# EasyEDA schematic Node Schematic EasyEDA File.json
TITLE: Node; REV: 1.0; Date: 2024-10-09; Sheet: 1/1; Drawn By: Chathura-De-Silva; Company: Firesense
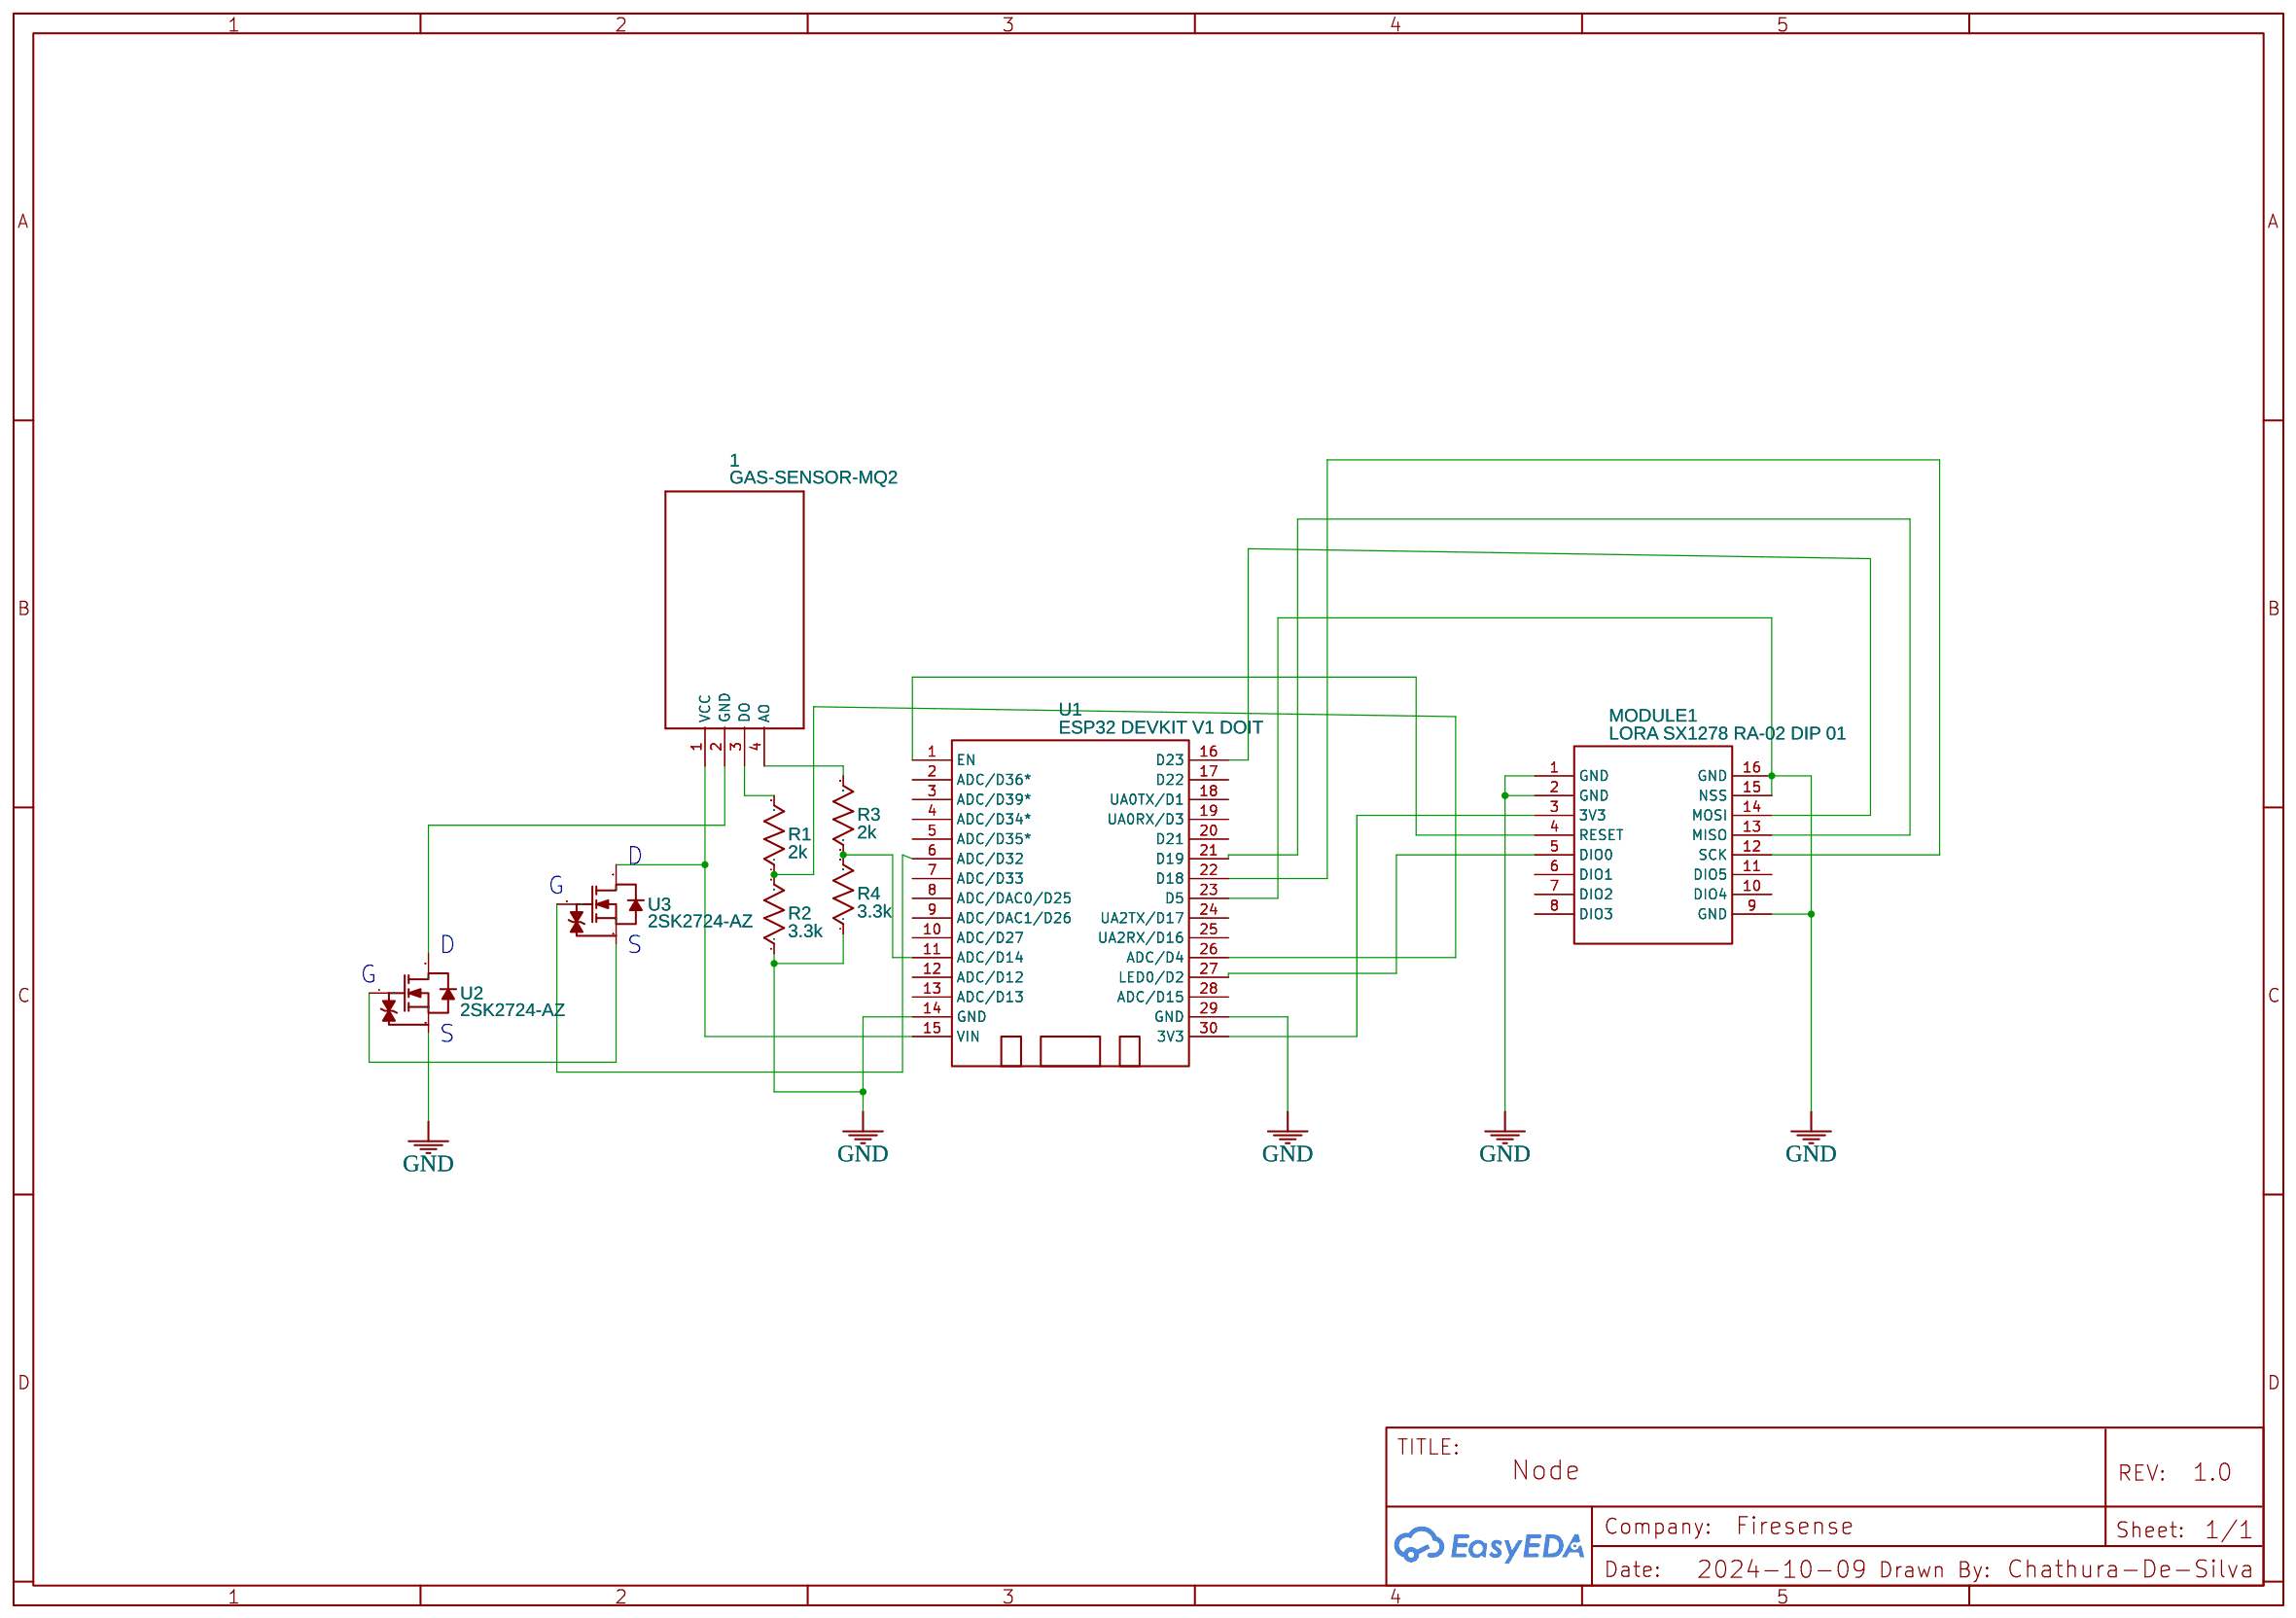
[diagram p0: schematic sheet]

## Parts
1  GAS-SENSOR-MQ2  [GAS-SENSOR-MQ2]
MODULE1  LORA SX1278 RA-02 DIP 01  [LORA SX1278 RA-02 DIP 01]
R1  2k  [R0603]
R2  3.3k  [R0603]
R3  2k  [R0603]
R4  3.3k  [R0603]
U1  ESP32 DEVKIT V1 DOIT  [DOIT-ESP32-DEVKIT-V1]
U2  2SK2724-AZ  [TO-220-3_L10.0-W4.6-P2.54-L]
U3  2SK2724-AZ  [TO-220-3_L10.0-W4.6-P2.54-L]

## Library data of the parts
1 = GAS-SENSOR-MQ2: Contributor: gtanaka6
MODULE1 = LORA SX1278 RA-02 DIP 01: Contributor: rhalfcaacbay
R1-R4 = R_0603_US: Contributor: LCEDA_Lib
U1 = ESP32 DEVKIT V1 DOIT: Contributor: ConceitoTeam
U2 U3 = 2SK2724-AZ: Contributor: lcsc; Supplier: LCSC; Supplier Part: C3282317; Manufacturer: RENESAS(瑞萨)/IDT; JLCPCB Part Class: Extended Part

## Nets
GND: MODULE1.1(GND) MODULE1.2(GND) MODULE1.9(GND) MODULE1.15(NSS) MODULE1.16(GND) R2.1 R4.1 U1.14(GND) U1.23(D5) U1.29(GND) U2.3(S)
Net-(1-1): 1.1(VCC) U1.15(VIN) U3.2(D)
Net-(1-2): 1.2(GND) U2.2(D)
Net-(1-3): 1.3(DO) R1.2
Net-(1-4): 1.4(AO) R3.2
Net-(MODULE1-3): MODULE1.3(3V3) U1.30(3V3)
Net-(MODULE1-4): MODULE1.4(RESET) U1.1(EN)
Net-(MODULE1-5): MODULE1.5(DIO0) U1.27(LED0/D2)
Net-(MODULE1-12): MODULE1.12(SCK) U1.22(D18)
Net-(MODULE1-13): MODULE1.13(MISO) U1.21(D19)
Net-(MODULE1-14): MODULE1.14(MOSI) U1.16(D23)
Net-(R1-1): R1.1 R2.2 U1.26(ADC/D4)
Net-(R3-1): R3.1 R4.2 U1.11(ADC/D14)
Net-(U1-6): U1.6(ADC/D32) U3.1(G)
Net-(U2-1): U2.1(G) U3.3(S)

Not connected (* = marked no-connect by the designer): MODULE1 6(DIO1) 7(DIO2) 8(DIO3) 10(DIO4) 11(DIO5); U1 2(ADC/D36*) 3(ADC/D39*) 4(ADC/D34*) 5(ADC/D35*) 7(ADC/D33) 8(ADC/DAC0/D25) 9(ADC/DAC1/D26) 10(ADC/D27) 12(ADC/D12) 13(ADC/D13) 17(D22) 18(UA0TX/D1) 19(UA0RX/D3) 20(D21) 24(UA2TX/D17) 25(UA2RX/D16) 28(ADC/D15)

## Notes on the sheet
- D
- G
- D
- S
- G
- S
